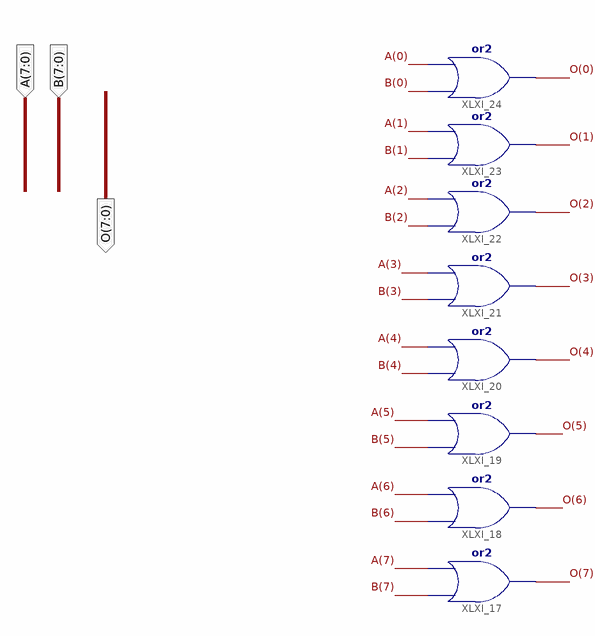
[diagram p0: schematic sheet 1]
// Xilinx ISE schematic ORBUS8.sch (spartan6) as structural Verilog: 8 symbols, 3 ports
module ORBUS8 (
  input  [7:0] A,
  input  [7:0] B,
  output [7:0] O
);

  or XLXI_17 (O[7], B[7], A[7]);
  or XLXI_18 (O[6], B[6], A[6]);
  or XLXI_19 (O[5], B[5], A[5]);
  or XLXI_20 (O[4], B[4], A[4]);
  or XLXI_21 (O[3], B[3], A[3]);
  or XLXI_22 (O[2], B[2], A[2]);
  or XLXI_23 (O[1], B[1], A[1]);
  or XLXI_24 (O[0], B[0], A[0]);
endmodule
